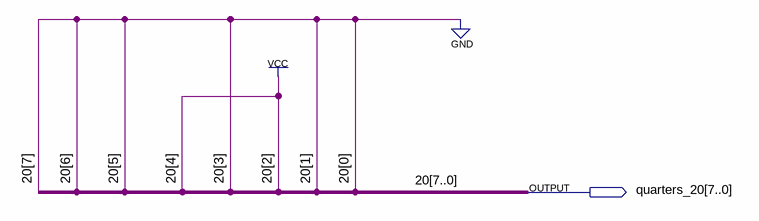
[diagram p0: schematic sheet]
// Quartus schematic quarters_20.bdf as structural Verilog: 0 symbols, 1 pins
module quarters_20 (
  output [7:0] quarters_20
);


  assign quarters_20 = 8'b00010100;
endmodule
